# Altium project BlindscontrollerMCU.PrjPcb
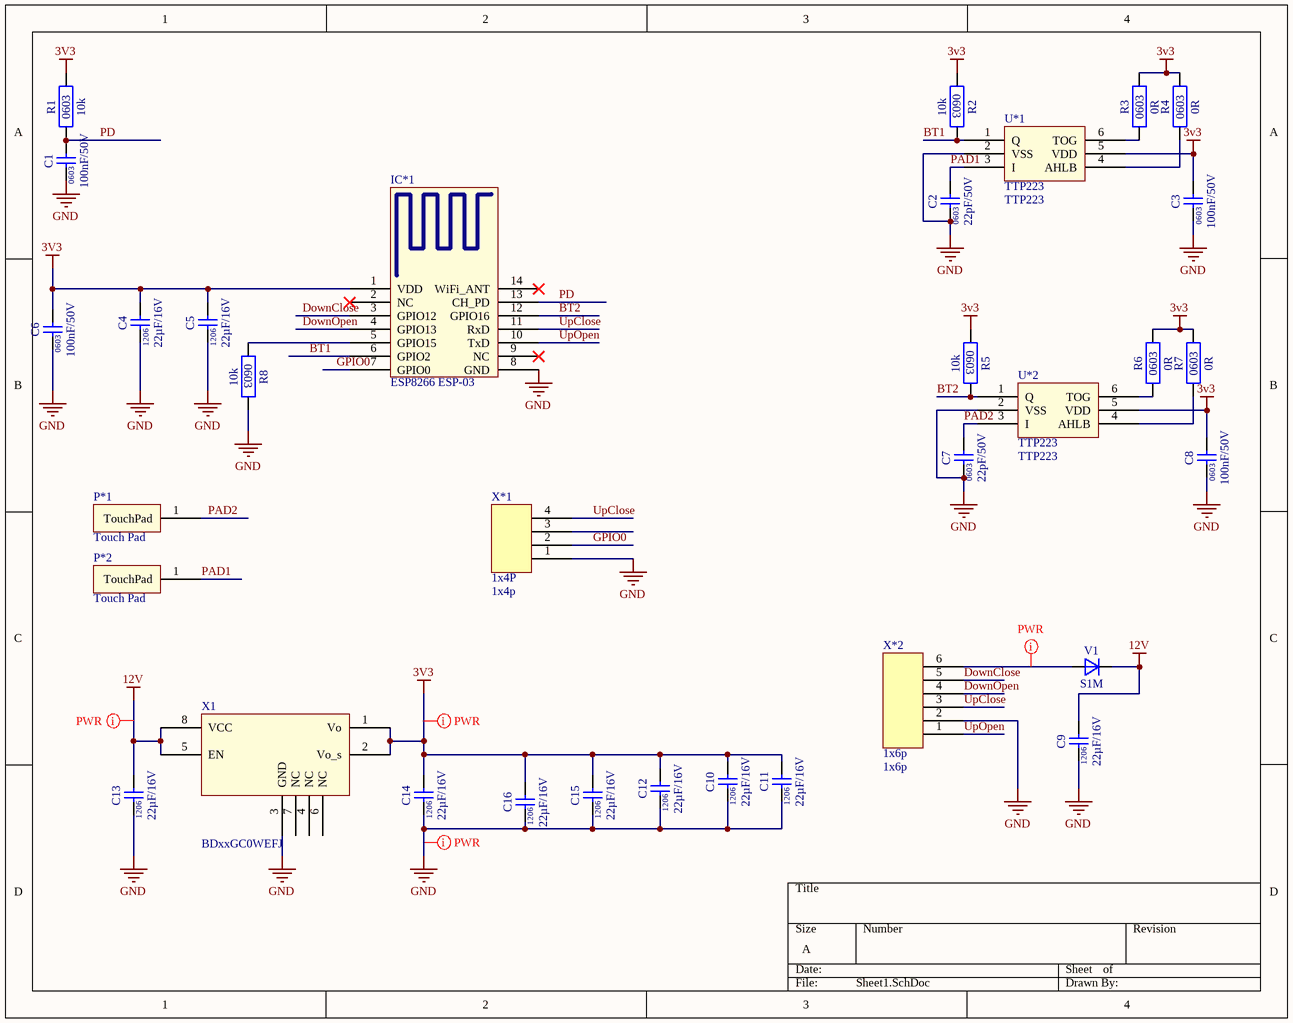
[diagram p0: Sheet1.SchDoc]
1 sheet, 33 parts. Net scope: global (net labels, ports and power ports of the same name join across sheets).
Board file: PCB1.PcbDoc

## Sheet Sheet1.SchDoc
size A

### Parts
C1  100nF/50V  [CAP_0603_IPC_B]
C2  22pF/50V  [CAP_0603_IPC_B]
C3  100nF/50V  [CAP_0603_IPC_B]
C4  22µF/16V  [CAP_1206_IPC_B]
C5  22µF/16V  [CAP_1206_IPC_B]
C6  100nF/50V  [CAP_0603_IPC_B]
C7  22pF/50V  [CAP_0603_IPC_B]
C8  100nF/50V  [CAP_0603_IPC_B]
C9  22µF/16V  [CAP_1206_IPC_B]
C10  22µF/16V  [CAP_1206_IPC_B]
C11  22µF/16V  [CAP_1206_IPC_B]
C12  22µF/16V  [CAP_1206_IPC_B]
C13  22µF/16V  [CAP_1206_IPC_B]
C14  22µF/16V  [CAP_1206_IPC_B]
C15  22µF/16V  [CAP_1206_IPC_B]
C16  22µF/16V  [CAP_1206_IPC_B]
IC*1  ESP8266 ESP-03  [ESP8266 ESP-03]
P*1  Touch Pad  [Touch Pad]
P*2  Touch Pad  [Touch Pad]
R1  10k  [RES_0603_IPC_B]
R2  10k  [RES_0603_IPC_B]
R3  0R  [RES_0603_IPC_B]
R4  0R  [RES_0603_IPC_B]
R5  10k  [RES_0603_IPC_B]
R6  0R  [RES_0603_IPC_B]
R7  0R  [RES_0603_IPC_B]
R8  10k  [RES_0603_IPC_B]
U*1  TTP223
U*2  TTP223
V1  S1M  [SMA_DO214AC]
X1  BDxxGC0WEFJ  [SO8_127P600X176-8N]
X*1  1x4P  [1x4p]
X*2  1x6p  [M22-7130642]

### Nets
3v3: C3.2 C4.2 C5.2 C6.2 C8.2 C10.2 C11.2 C12.2 C14.2 C15.2 C16.2 IC*1.1(VDD) R1.2 R2.1 R3.2 R4.2 R5.1 R6.2 R7.2 U*1.5(VDD) U*2.5(VDD) X1.1(Vo) X1.2(Vo_s)
12V: C9.2 C13.2 V1.K X1.5(EN) X1.8(VCC)
GND: C1.1 C2.1 C3.1 C4.1 C5.1 C6.1 C7.1 C8.1 C9.1 C10.1 C11.1 C12.1 C13.1 C14.1 C15.1 C16.1 IC*1.8(GND) R8.2 U*1.2(VSS) U*2.2(VSS) X1.3(GND) X*1.1 X*2.2
BT1: IC*1.6(GPIO2) R2.2 U*1.1(Q)
BT2: IC*1.12(GPIO16) R5.2 U*2.1(Q)
DownClose: IC*1.3(GPIO12) X*2.5
DownOpen: IC*1.4(GPIO13) X*2.4
GPIO0: IC*1.7(GPIO0) X*1.2
PAD1: C2.2 P*2.1(TouchPad) U*1.3(I)
PAD2: C7.2 P*1.1(TouchPad) U*2.3(I)
PD: C1.2 IC*1.13(CH_PD) R1.1
UpClose: IC*1.11(RxD) X*1.4 X*2.3
UpOpen: IC*1.10(TxD) X*2.1
NetIC*1_5: IC*1.5(GPIO15) R8.1
NetR3_1: R3.1 U*1.6(TOG)
NetR4_1: R4.1 U*1.4(AHLB)
NetR6_1: R6.1 U*2.6(TOG)
NetR7_1: R7.1 U*2.4(AHLB)
NetV1_A: V1.A X*2.6

Not connected (* = marked no-connect by the designer): IC*1 2(NC)* 9(NC)* 14(WiFi_ANT)*; X1 4(NC) 6(NC) 7(NC); X*1 3

### Layout directives
net class PWR: 3v3, 12V, GND, NetV1_A

### Notes on the sheet
- (in symbol 0R_0603_01-0080) 0603
- (in symbol 10k_0603_01-0487) 0603
- (in symbol 22µF_10V_1206_02-4857) 1206
- (in symbol 56pF_50V_0603_02-0492) 0603
- (in symbol 100nF_50V_0603_02-1902) 0603

### Library data of the parts
C1 C3 C6 C8 = 100nF_50V_0603_02-1902: 02-1902 - SMD Capacitor 0603 100nF 50V X7R; PcbLib: Capacitors SMT.PcbLib; Toleranz: 10%; Prüfstatus: geprüft; EX-relevant: EX; FuSi-relevant: FuSi; HelpURL: K:\Solutions\ETW\Projekte\Bibliotheken\Bauteil-Neuanlagen\Datenblätter\02er-Parts\; Partnumber: 02-1902; Publisher: DD; Published: 02.12.2010; PackageDescription: SMD Capacitor 0603; Spannung: 50V; Typ/Material: X7R; Value: 100nF
C2 C7 = 56pF_50V_0603_02-0492: 02-0492 - SMD Capacitor 0603 56pF 50V C0G; PcbLib: Capacitors SMT.PcbLib; Toleranz: 5%; Prüfstatus: geprüft; EX-relevant: EX; FuSi-relevant: FuSi; Partnumber: 02-0492; Publisher: DG; Published: 11.09.2012; PackageDescription: SMD Capacitor 0603; Spannung: 50V; Typ/Material: C0G; Value: 56pF
C4 C5 C9-C16 = 22µF_10V_1206_02-4857: 02-4857 - SMD Capacitor 1206 22µF 10V X7R; PcbLib: Capacitors SMT.PcbLib; Toleranz: 20%; EX-relevant: EX; FuSi-relevant: FuSi; HelpURL: K:\Solutions\ETW\Projekte\Bibliotheken\Bauteil-Neuanlagen\Datenblätter\02er-Parts\02-4834_C3216X5R1H106M160AB.pdf; Partnumber: 02-4857; Publisher: RR; Published: 22.09.2015; PackageDescription: CAP_1206_IPC_B; Spannung: 10V; Typ/Material: X7R; Value: 22µF
R1 R2 R5 R8 = 10k_0603_01-0487: 01-0487 - SMD Resistor 0603 0.1W 1%; PcbLib: Resistors SMT.PcbLib; TCR: 100ppm; Prüfstatus: geprüft; EX-relevant: EX; FuSi-relevant: FuSi; HelpURL: N:\data\Solutions\etw\Projekte\Bibliotheken\Bauteil-Neuanlagen\Datenblätter\01er-Parts\Yageo_Chip_Resistors_0603.pdf; Partnumber: 01-0487; LatestRevisionDate: *; LatestRevisionNote: *; Publisher: DG; Published: 21.05.2012; PackageDescription: SMD Resistor 0603; Toleranz: 1%; Leistung: 0.1W; Value: 10k
R3 R4 R6 R7 = 0R_0603_01-0080: 01-0080 - SMD Resistor 0603 0.1W 5%; Manufacturer / Manufacturer Name: YAGEO (F)# RC0603JR-070RL; PcbLib: Resistors SMT.PcbLib; TCR: 200ppm; Prüfstatus: geprüft; Value: 1p; EX-relevant: EX; FuSi-relevant: FuSi; HelpURL: N:\data\Solutions\etw\Projekte\Bibliotheken\Bauteil-Neuanlagen\Datenblätter\01er-Parts\Yageo_Chip_Resistors_0603.pdf; Partnumber: 01-0080; LatestRevisionDate: *; LatestRevisionNote: *; Publisher: RB; Published: 100922; PackageDescription: SMD Resistor 0603; Toleranz: 5%; Leistung: 0.1W
V1 = D_Diode_1.000V_1A_08-5559: 08-5559_Diode_SMT_SMA_DO214AC_1.000V_1A; PcbLib: Diodes, LEDs, Displays, Lightpipes.PcbLib; Prüfstatus: geprüft; Partnumber: 08-5559; LatestRevisionDate: *; LatestRevisionNote: *; Publisher: JK; Published: 28.02.2014; PackageDescription: SMA
X*1 = 1x4P: Manufacturer: TI; Distribuitor: Mouser; Distribuitor Code: 926-LM3671MF-3.3NOPB; Manufacturer Code: 1x4p
X*2 = 1x6p: Manufacturer: TI; Distribuitor: Mouser; Distribuitor Code: 926-LM3671MF-3.3NOPB; Manufacturer Code: 1x6p